# EAGLE design sensors (EAGLE 5.05)
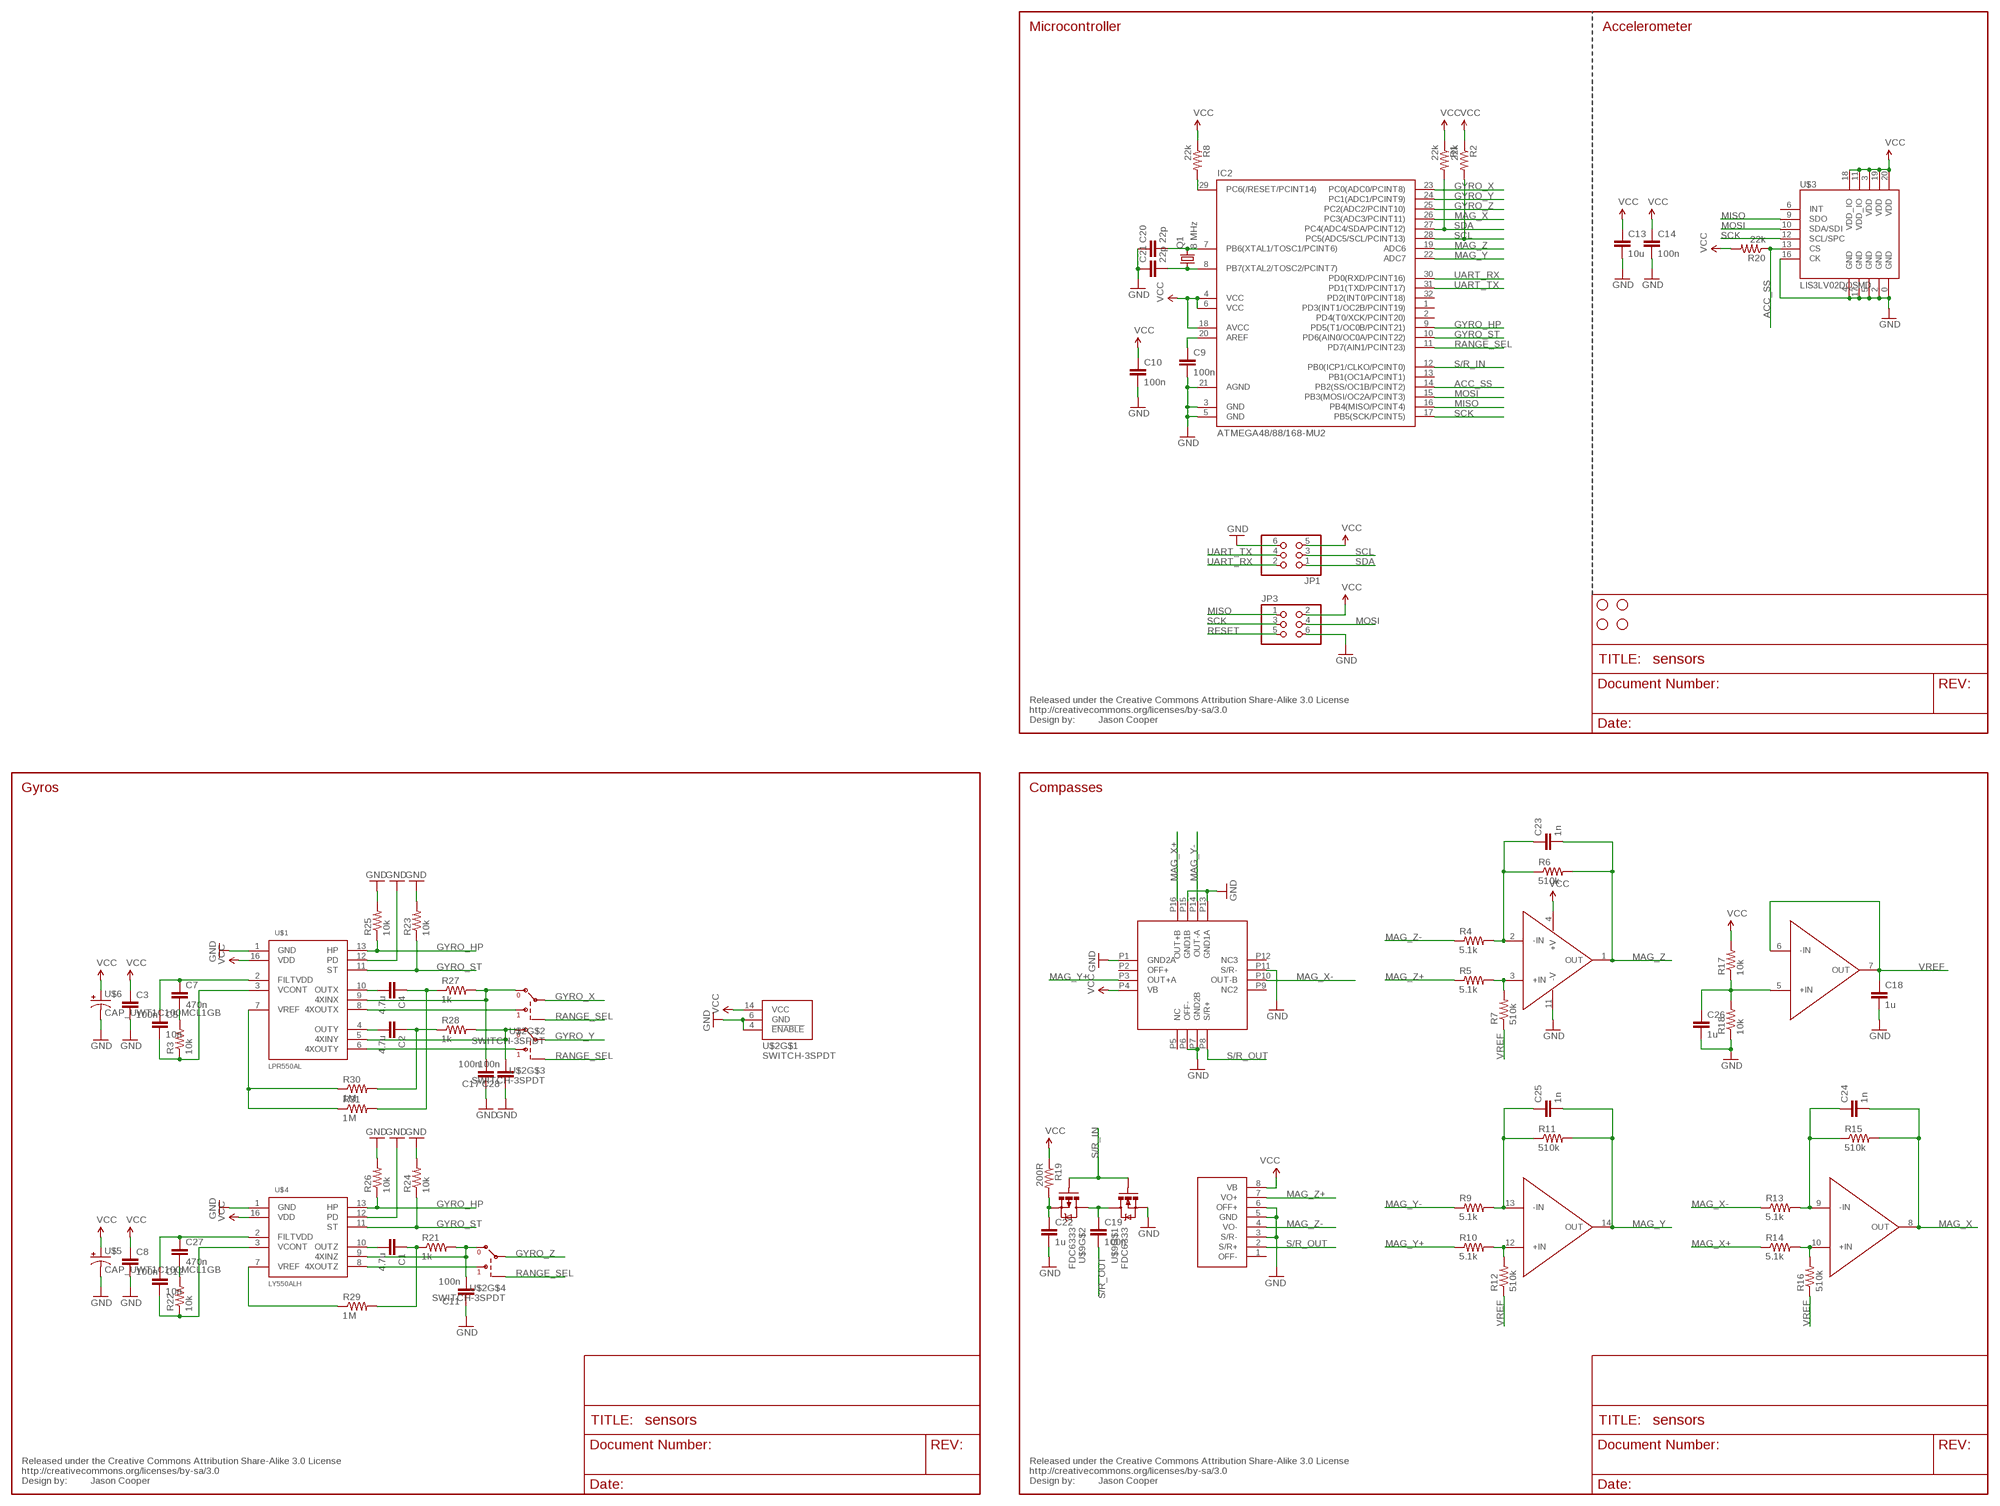
[diagram p0: schematic, sheet 1]

## Parts
C1  4.7u  C-EUC0805  [C0805]
C2  4.7u  C-EUC0805  [C0805]
C3  100n  C-EUC0805  [C0805]
C4  4.7u  C-EUC0805  [C0805]
C5  10n  C-EUC0805  [C0805]
C7  470n  C-EUC0805  [C0805]
C8  100n  C-EUC0805  [C0805]
C9  100n  C-EUC0805  [C0805]
C10  100n  C-EUC0805  [C0805]
C11  100n  C-EUC0805  [C0805]
C12  10n  C-EUC0805  [C0805]
C13  10u  C-EUC0805  [C0805]
C14  100n  C-EUC0805  [C0805]
C17  100n  C-EUC0805  [C0805]
C18  1u  C-EUC0805  [C0805]
C19  100n  C-EUC0805  [C0805]
C20  22p  C-EUC0805  [C0805]
C21  22p  C-EUC0805  [C0805]
C22  1u  C-EUC0805  [C0805]
C23  1n  C-EUC0805  [C0805]
C24  1n  C-EUC0805  [C0805]
C25  1n  C-EUC0805  [C0805]
C26  1u  C-EUC0805  [C0805]
C27  470n  C-EUC0805  [C0805]
C28  100n  C-EUC0805  [C0805]
IC2  ATMEGA48/88/168-MU2  [QFN32]
JP1  PINHD-2X3  [2X03]
JP2  STAND-OFF  [STAND-OFF]
JP3  PINHD-2X3  [2X03]
JP4  STAND-OFF  [STAND-OFF]
JP5  STAND-OFF  [STAND-OFF]
JP6  STAND-OFF  [STAND-OFF]
Q1  8 MHz  CRYSTAL5X3  [CRYSTAL-SMD-5X3]
R1  22k  R-US_R0805  [R0805]
R2  22k  R-US_R0805  [R0805]
R3  10k  R-US_R0805  [R0805]
R4  5.1k  R-US_R0805  [R0805]
R5  5.1k  R-US_R0805  [R0805]
R6  510k  R-US_R0805  [R0805]
R7  510k  R-US_R0805  [R0805]
R8  22k  R-US_R0805  [R0805]
R9  5.1k  R-US_R0805  [R0805]
R10  5.1k  R-US_R0805  [R0805]
R11  510k  R-US_R0805  [R0805]
R12  510k  R-US_R0805  [R0805]
R13  5.1k  R-US_R0805  [R0805]
R14  5.1k  R-US_R0805  [R0805]
R15  510k  R-US_R0805  [R0805]
R16  510k  R-US_R0805  [R0805]
R17  10k  R-US_R0805  [R0805]
R18  10k  R-US_R0805  [R0805]
R19  200R  R-US_R0805  [R0805]
R20  22k  R-US_R0805  [R0805]
R21  1k  R-US_R0805  [R0805]
R22  10k  R-US_R0805  [R0805]
R23  10k  R-US_R0805  [R0805]
R24  10k  R-US_R0805  [R0805]
R25  10k  R-US_R0805  [R0805]
R26  10k  R-US_R0805  [R0805]
R27  1k  R-US_R0805  [R0805]
R28  1k  R-US_R0805  [R0805]
R29  1M  R-US_R0805  [R0805]
R30  1M  R-US_R0805  [R0805]
R31  1M  R-US_R0805  [R0805]
U$1  LPR550AL  [LGA16]
U$2  SWITCH-3SPDT  [QFN16]
U$3  LIS3LV02DQSMD  [QFN-28]
U$4  LY550ALH  [LGA16]
U$5  CAP_UWT1C100MCL1GB  [CAP_UWT1C100MCL1GB]
U$6  CAP_UWT1C100MCL1GB  [CAP_UWT1C100MCL1GB]
U$7  HMC1052L  [16LPCC]
U$8  LMV324  [SO014]
U$9  FDC6333  [SSOT-6]
U$10  HMC1051ZL  [HMC1051ZL]
U$11  CREATIVE_COMMONS  [CREATIVE_COMMONS]
U$13  CREATIVE_COMMONS  [CREATIVE_COMMONS]
U$17  CREATIVE_COMMONS  [CREATIVE_COMMONS]

## Nets
ACC_SS: IC2.14(PB2(SS/OC1B/PCINT2)) R20.1 U$3.13(CS)
GND: C3.2 C8.2 C9.2 C10.2 C11.1 C13.2 C14.2 C17.1 C18.2 C20.1 C21.1 C22.2 C26.2 C28.1 IC2.3(GND) IC2.5(GND) IC2.21(AGND) JP1.6 JP3.6 R18.1 R23.2 R24.2 R25.2 R26.2 U$1.1(GND) U$1.12(PD) U$2.4(!ENABLE) U$2.6(GND) U$3.0(GND) U$3.2(GND) U$3.4(GND) U$3.5(GND) U$3.16(CK) U$3.17(GND) U$4.1(GND) U$4.12(PD) U$5.NEG(-) U$6.NEG(-) U$7.P1(GND2A) U$7.P6(OFF-) U$7.P7(GND2B) U$7.P11(S/R-) U$7.P13(GND1A) U$7.P15(GND1B) U$8.11(-V) U$9.P$5(S) U$10.3(S/R-) U$10.5(GND) U$10.6(OFF+)
GYRO_HP: IC2.9(PD5(T1/OC0B/PCINT21)) R25.1 R26.1 U$1.13(HP) U$4.13(HP)
GYRO_ST: IC2.10(PD6(AIN0/OC0A/PCINT22)) R23.1 R24.1 U$1.11(ST) U$4.11(ST)
GYRO_X: IC2.23(PC0(ADC0/PCINT8)) U$2.12(COM)
GYRO_Y: IC2.24(PC1(ADC1/PCINT9)) U$2.13(COM)
GYRO_Z: IC2.25(PC2(ADC2/PCINT10)) U$2.2(COM)
MAG_X: C24.2 IC2.26(PC3(ADC3/PCINT11)) R15.2 U$8.8(OUT)
MAG_X+: R14.1 U$7.P16(OUT+B)
MAG_X-: R13.1 U$7.P10(OUT-B)
MAG_Y: C25.2 IC2.22(ADC7) R11.2 U$8.14(OUT)
MAG_Y+: R10.1 U$7.P3(OUT+A)
MAG_Y-: R9.1 U$7.P14(OUT-A)
MAG_Z: C23.2 IC2.19(ADC6) R6.2 U$8.1(OUT)
MAG_Z+: R5.1 U$10.7(VO+)
MAG_Z-: R4.1 U$10.4(VO-)
MISO: IC2.16(PB4(MISO/PCINT4)) JP3.1 U$3.9(SDO)
MOSI: IC2.15(PB3(MOSI/OC2A/PCINT3)) JP3.4 U$3.10(SDA/SDI)
N$1: U$1.8(4XOUTX) U$2.11(NO)
N$2: C5.1 C7.1 U$1.2(FILTVDD)
N$3: C1.2 U$4.10(OUTZ)
N$4: C1.1 R21.1 R29.2
N$5: R29.1 U$4.7(VREF)
N$6: C5.2 R3.1 U$1.3(VCONT)
N$7: C9.1 IC2.20(AREF)
N$8: C4.2 U$1.10(OUTX)
N$9: C2.2 U$1.4(OUTY)
N$10: C2.1 R28.1 R30.2
N$11: R30.1 R31.1 U$1.7(VREF)
N$12: C7.2 R3.2
N$13: C4.1 R27.1 R31.2
N$16: C23.1 R4.2 R6.1 U$8.2(-IN)
N$17: R5.2 R7.2 U$8.3(+IN)
N$18: C25.1 R9.2 R11.1 U$8.13(-IN)
N$19: R10.2 R12.2 U$8.12(+IN)
N$21: C24.1 R13.2 R15.1 U$8.9(-IN)
N$22: R14.2 R16.2 U$8.10(+IN)
N$23: C26.1 R17.1 R18.2 U$8.5(+IN)
N$24: C19.1 U$9.P$4(D) U$9.P$6(D)
N$25: C22.1 R19.2 U$9.P$2(S)
N$26: C11.2 R21.2 U$2.3(NC) U$4.9(4XINZ)
N$27: U$2.1(NO) U$4.8(4XOUTZ)
N$28: C12.1 C27.1 U$4.2(FILTVDD)
N$29: C12.2 R22.1 U$4.3(VCONT)
N$30: C27.2 R22.2
N$33: C28.2 R28.2 U$1.5(4XINY) U$2.16(NC)
N$34: C17.2 R27.2 U$1.9(4XINX) U$2.10(NC)
N$36: U$1.6(4XOUTY) U$2.15(NO)
N$37: C20.2 IC2.7(PB6(XTAL1/TOSC1/PCINT6)) Q1.3
N$38: C21.2 IC2.8(PB7(XTAL2/TOSC2/PCINT7)) Q1.1
RANGE_SEL: IC2.11(PD7(AIN1/PCINT23)) U$2.7(IN) U$2.8(IN) U$2.9(IN)
RESET: IC2.29(PC6(/RESET/PCINT14)) JP3.5 R8.2
S/R_IN: IC2.12(PB0(ICP1/CLKO/PCINT0)) U$9.P$1(G) U$9.P$3(G)
S/R_OUT: C19.2 U$7.P8(S/R+) U$10.2(S/R+)
SCK: IC2.17(PB5(SCK/PCINT5)) JP3.3 U$3.12(SCL/SPC)
SCL: IC2.28(PC5(ADC5/SCL/PCINT13)) JP1.3 R2.2
SDA: IC2.27(PC4(ADC4/SDA/PCINT12)) JP1.1 R1.2
UART_RX: IC2.30(PD0(RXD/PCINT16)) JP1.2
UART_TX: IC2.31(PD1(TXD/PCINT17)) JP1.4
VCC: C3.1 C8.1 C10.1 C13.1 C14.1 IC2.4(VCC) IC2.6(VCC) IC2.18(AVCC) JP1.5 JP3.2 R1.1 R2.1 R8.1 R17.2 R19.1 R20.2 U$1.16(VDD) U$2.14(VCC) U$3.3(VDD) U$3.11(VDD_IO) U$3.18(VDD_IO) U$3.19(VDD) U$3.20(VDD) U$4.16(VDD) U$5.POS(+) U$6.POS(+) U$7.P4(VB) U$8.4(+V) U$10.8(VB)
VREF: C18.1 R7.1 R12.1 R16.1 U$8.6(-IN) U$8.7(OUT)
Unconnected: IC2.1(PD3(INT1/OC2B/PCINT19)) IC2.2(PD4(T0/XCK/PCINT20)) IC2.13(PB1(OC1A/PCINT1)) IC2.32(PD2(INT0/PCINT18)) U$3.6(INT) U$7.P2(OFF+) U$7.P5(NC) U$7.P9(NC2) U$7.P12(NC3) U$10.1(OFF-)

## Notes on the sheet
- Microcontroller | Accelerometer
- Jason Cooper
- Gyros | Compasses
- Jason Cooper | Jason Cooper

## Library data of the parts
C1-C5 C7-C14 C17-C28 = rcl:C-EU: CAPACITOR, European symbol
IC2 = jason:ATMEGA48/88/168
JP1 JP3 = jason:PINHD-2X3: PIN HEADER
JP2 JP4-JP6 = jason:STAND-OFF: Stand Off This is the mechanical footprint for a #4 phillips button head screw. Use the keepout ring to avoid running the screw head into surrounding components. SKU : PRT-00447
Q1 = jason:CRYSTAL: Crystals Various standard crystals. Proven footprints. Spark Fun Electronics SKU : COM-00534
R1-R31 = rcl:R-US_: RESISTOR, American symbol
U$1 = jason:LPR550AL: LPR550AL
U$2 = jason:SWITCH-3SPDT
U$3 = jason:LIS3LV02DQ
U$4 = jason:LY550ALH: LY550ALH
U$5 U$6 = jason:CAP_UWT1C100MCL1GB
U$7 = jason:HMC1052L: HMC1052L Dual axis magnetic sensor. Used for compass and magnetometer applications. Schematic and footprint are not tested and probably need fixing. Spark Fun Electronics SKU : COM-00708
U$8 = jason:LMV324
U$9 = jason:FDC6333
U$10 = jason:HMC1051ZL
U$11 U$13 U$17 = SparkFun:CREATIVE_COMMONS

## Board
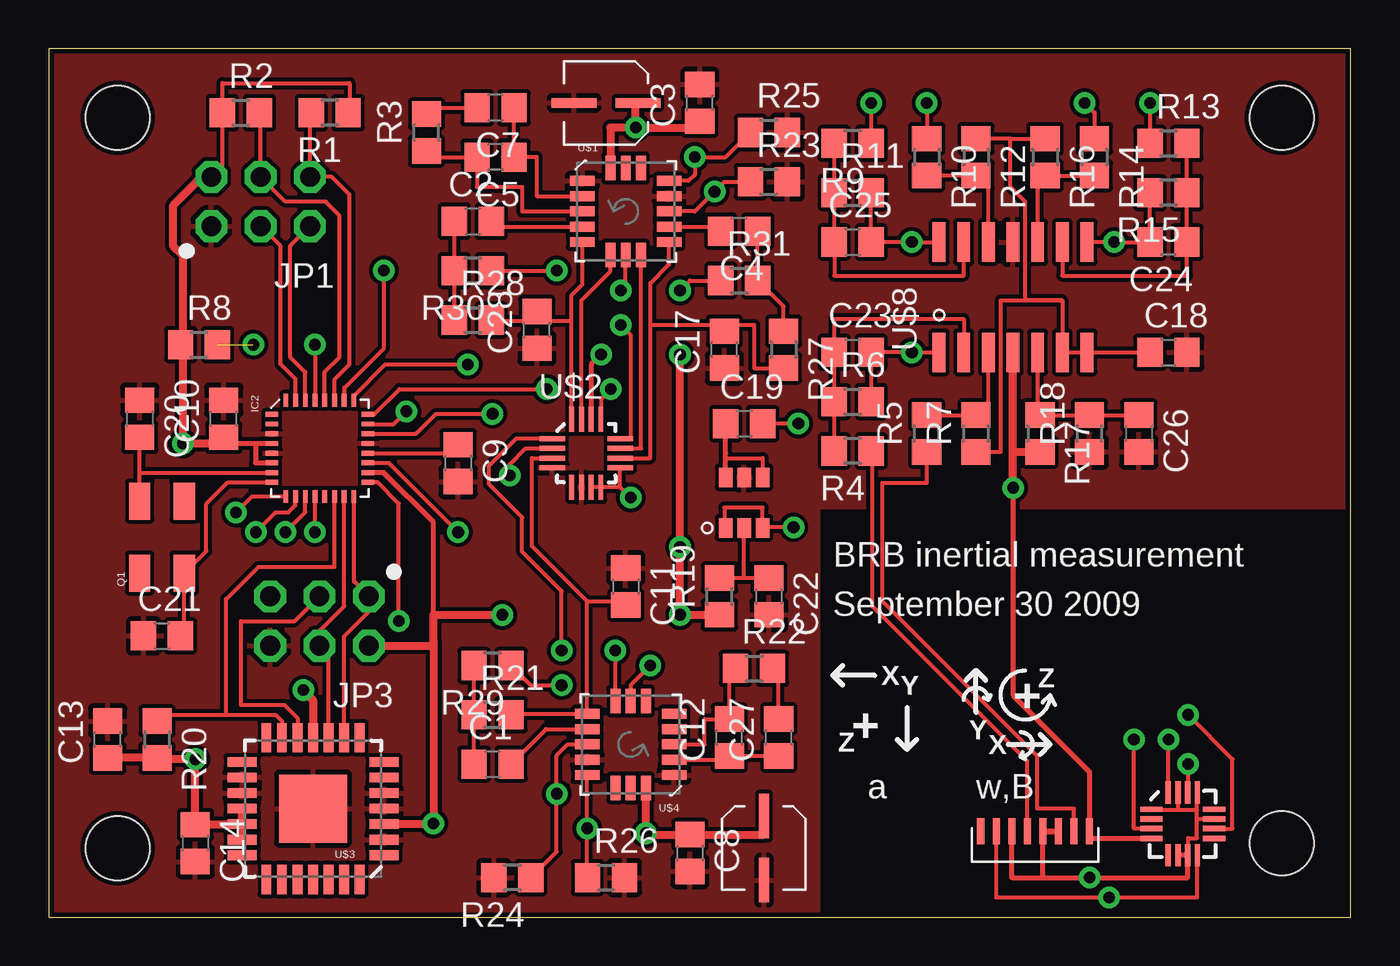
[diagram p1: board, top side]
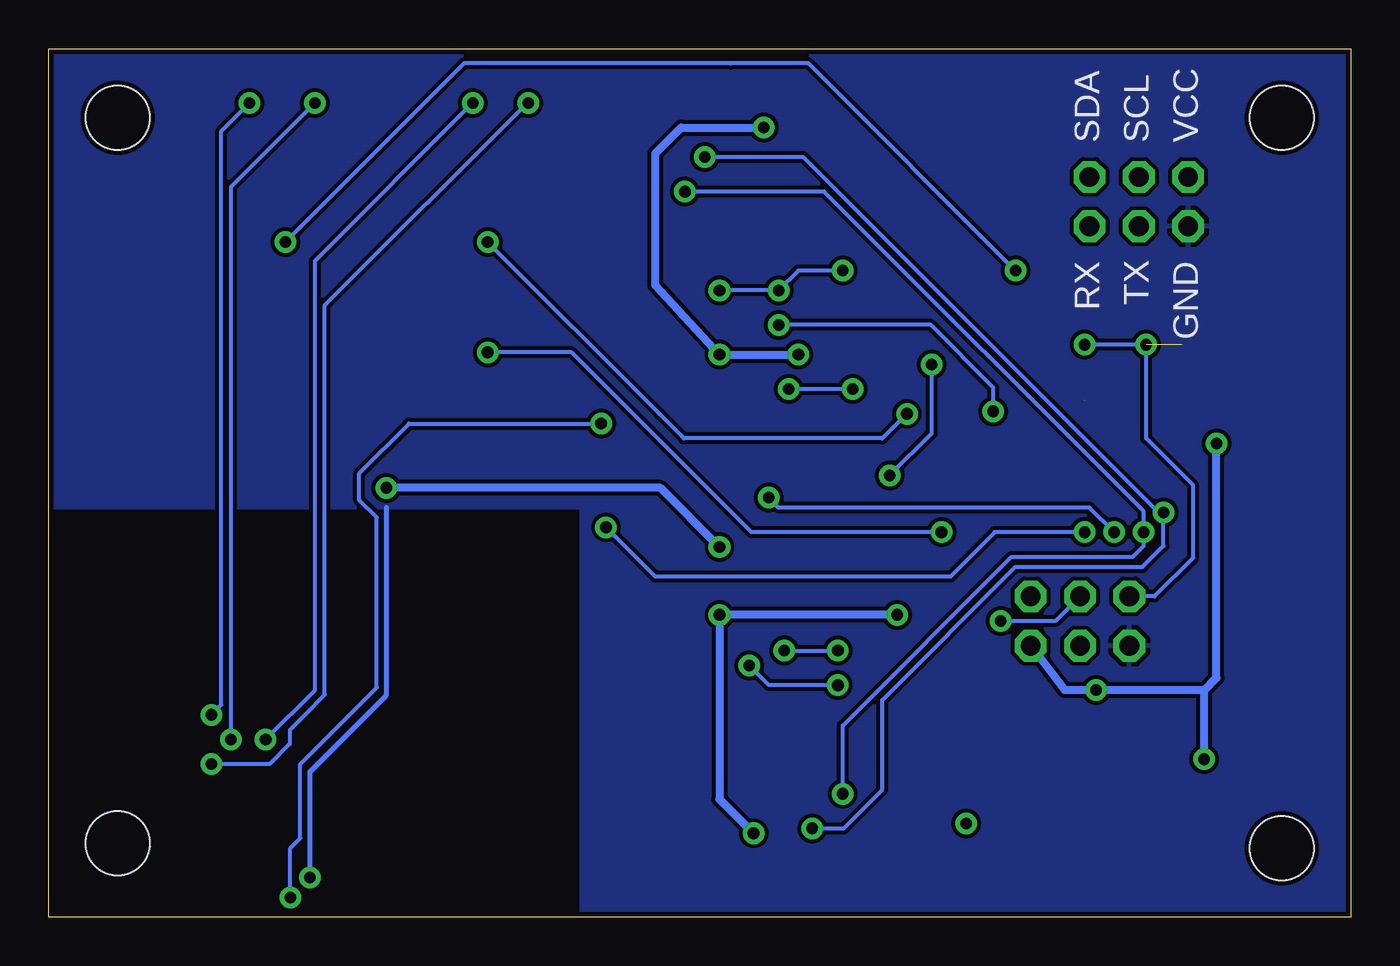
[diagram p2: board, bottom side, seen from below]

Size 67.06 x 44.7 mm. Coordinates in mm from the lower left corner, seen from the top.
Outline: 0,0 67.06,0 67.06,44.7 0,44.7 0,0
Copper layers (1*16): Top 0.035mm / dielectric 1.5mm / Bottom 0.035mm
Design rules "SparkFun": minimum track width 8mil, minimum drill 20mil, track to track 8mil, track to pad 8mil, pad to pad 8mil, via to via 8mil, smd to smd 8mil, copper to edge 10mil, drill to drill 8mil, minimum pad ring 12mil, minimum via ring 10mil, stop-mask expansion 4mil, vias tented up to drill 25mil, thermal gap 10mil

### Footprints (pad centres in the part's own frame; a part is rotated, then mirrored left to right if it is on the bottom)
C0805 = smd 1.3 x 1.5: 1 -0.95,0; 2 0.95,0
QFN32 = smd 0.25 x 0.65: 1 -1.75,-2.475; 2 -1.25,-2.475; 3 -0.75,-2.475; 4 -0.25,-2.475; 5 0.25,-2.475; 6 0.75,-2.475; 7 1.25,-2.475; 8 1.75,-2.475; 17 1.75,2.475; 18 1.25,2.475; 19 0.75,2.475; 20 0.25,2.475; 21 -0.25,2.475; 22 -0.75,2.475; 23 -1.25,2.475; 24 -1.75,2.475 | smd 0.65 x 0.25: 9 2.475,-1.75; 10 2.475,-1.25; 11 2.475,-0.75; 12 2.475,-0.25; 13 2.475,0.25; 14 2.475,0.75; 15 2.475,1.25; 16 2.475,1.75; 25 -2.475,1.75; 26 -2.475,1.25; 27 -2.475,0.75; 28 -2.475,0.25; 29 -2.475,-0.25; 30 -2.475,-0.75; 31 -2.475,-1.25; 32 -2.475,-1.75
2X03 = drill 1.016 octagon: 1 -2.54,-1.27; 2 -2.54,1.27; 3 0,-1.27; 4 0,1.27; 5 2.54,-1.27; 6 2.54,1.27
STAND-OFF = hole 3.302: 0,0
CRYSTAL-SMD-5X3 = smd 1.9 x 1.1: 1 -1.85,-1.15; 2 1.85,-1.15; 3 1.85,1.15; 4 -1.85,1.15
R0805 = smd 1.3 x 1.5: 1 -0.95,0; 2 0.95,0
LGA16 = smd 1.27 x 0.508: 1 -2.235,1.575; 2 -2.235,0.787; 3 -2.235,0; 4 -2.235,-0.787; 5 -2.235,-1.575; 9 2.235,-1.575; 10 2.235,-0.787; 11 2.235,0; 12 2.235,0.787; 13 2.235,1.575 | smd 0.508 x 1.27: 6 -0.787,-2.235; 7 0,-2.235; 8 0.787,-2.235; 14 0.787,2.235; 15 0,2.235; 16 -0.787,2.235
QFN16 = smd 1.3 x 0.25: 1 -1.75,0.75; 2 -1.75,0.25; 3 -1.75,-0.25; 4 -1.75,-0.75; 9 1.75,-0.75; 10 1.75,-0.25; 11 1.75,0.25; 12 1.75,0.75 | smd 0.25 x 1.3: 5 -0.75,-1.75; 6 -0.25,-1.75; 7 0.25,-1.75; 8 0.75,-1.75; 13 0.75,1.75; 14 0.25,1.75; 15 -0.25,1.75; 16 -0.75,1.75
QFN-28 = smd 3.5 x 3.5: 0 0,0 | smd 1.5 x 0.5: 1 -3.65,2.4; 2 -3.65,1.6; 3 -3.65,0.8; 4 -3.65,0; 5 -3.65,-0.8; 6 -3.65,-1.6; 7 -3.65,-2.4; 15 3.65,-2.4; 16 3.65,-1.6; 17 3.65,-0.8; 18 3.65,0; 19 3.65,0.8; 20 3.65,1.6; 21 3.65,2.4 | smd 0.5 x 1.5: 8 -2.4,-3.65; 9 -1.6,-3.65; 10 -0.8,-3.65; 11 0,-3.65; 12 0.8,-3.65; 13 1.6,-3.65; 14 2.4,-3.65; 22 2.4,3.65; 23 1.6,3.65; 24 0.8,3.65; 25 0,3.65; 26 -0.8,3.65; 27 -1.6,3.65; 28 -2.4,3.65
CAP_UWT1C100MCL1GB = smd 0.5 x 2.3: NEG 0,-1.65; POS 0,1.65
16LPCC = smd 1.15 x 0.28: P1 -0.12,2.25; P2 -0.12,1.75; P3 -0.12,1.25; P4 -0.12,0.75; P9 3.12,0.75; P10 3.12,1.25; P11 3.12,1.75; P12 3.12,2.25 | smd 0.28 x 1.15: P5 0.75,-0.12; P6 1.25,-0.12; P7 1.75,-0.12; P8 2.25,-0.12; P13 2.25,3.12; P14 1.75,3.12; P15 1.25,3.12; P16 0.75,3.12
SO014 = smd 0.66 x 2.032: 1 -3.175,-2.68; 2 -1.905,-2.68; 3 -0.635,-2.68; 4 0.635,-2.68; 5 1.905,-2.68; 6 3.175,-2.68; 7 4.445,-2.68; 8 4.445,2.997; 9 3.175,2.997; 10 1.905,2.997; 11 0.635,2.997; 12 -0.635,2.997; 13 -1.905,2.997; 14 -3.175,2.997
SSOT-6 = smd 0.7 x 1: P$1 -0.95,-1.3; P$2 0,-1.3; P$3 0.95,-1.3; P$4 0.95,1.3; P$5 0,1.3; P$6 -0.95,1.3
HMC1051ZL = smd 0.368 x 1.321: 1 5.601,0.152; 2 4.801,0.152; 3 4,0.152; 4 3.2,0.152; 5 2.4,0.152; 6 1.6,0.152; 7 0.8,0.152; 8 0,0.152

### Placement (x,y rotation side)
C1  22.86,7.87 0 top
C2  21.84,35.81 0 top
C3  33.53,41.91 90 top
C4  35.56,35.31 180 top
C5  23.01,39.12 180 top
C7  23.01,41.66 180 top
C8  33.02,3.3 270 top
C9  21.08,23.37 270 top
C10  9.02,25.65 90 top
C11  29.72,17.02 270 top
C12  35.05,9.25 90 top
C13  3.05,9.14 90 top
C14  7.55,3.81 270 top
C17  34.8,29.21 90 top
C18  57.66,29.07 0 top
C19  35.81,25.4 0 top
C20  4.69,25.65 270 top
C21  5.84,14.48 0 top
C22  37.08,16.51 270 top
C23  41.4,29.07 0 top
C24  57.66,34.75 180 top
C25  41.4,34.75 0 top
C26  56.13,24.89 270 top
C27  37.59,9.25 90 top
C28  25.15,30.23 90 top
IC2  13.97,24.13 270 top
JP1  10.92,36.83 180 top
JP2  3.56,41.15 0 top
JP3  13.95,15.24 180 top
JP4  3.56,3.56 0 top
JP5  63.5,41.15 0 top
JP6  63.5,3.81 0 top
Q1  5.84,19.56 90 top
R1  14.48,41.4 180 top
R2  9.91,41.4 0 top
R3  19.46,40.39 90 top
R4  41.4,23.99 180 top
R5  45.21,24.89 90 top
R6  41.4,26.53 0 top
R7  47.75,24.89 90 top
R8  7.75,29.46 0 top
R9  41.4,39.83 180 top
R10  45.21,39.12 270 top
R11  41.4,37.29 0 top
R12  47.75,39.12 270 top
R13  57.66,39.83 0 top
R14  53.85,39.12 270 top
R15  57.66,37.29 180 top
R16  51.31,39.12 270 top
R17  51.05,24.89 270 top
R18  53.59,24.89 90 top
R19  34.54,16.51 90 top
R20  5.59,9.14 270 top
R21  22.86,10.41 0 top
R22  36.32,12.8 0 top
R23  37.08,37.85 0 top
R24  23.88,2.03 180 top
R25  37.08,40.39 0 top
R26  28.7,2.03 0 top
R27  37.85,29.21 270 top
R28  21.84,30.73 0 top
R29  22.86,12.95 180 top
R30  21.84,33.27 180 top
R31  35.56,32.77 0 top
U$1  29.72,36.32 0 top
U$2  27.69,23.88 0 top
U$3  13.62,5.59 180 top
U$4  29.97,8.89 180 top
U$5  36.83,3.56 0 top
U$6  28.7,41.91 270 top
U$7  56.9,3.3 0 top
U$8  49.02,31.75 0 top
U$9  35.81,21.34 0 top
U$10  53.59,4.57 180 top
U$11  15.75,-9.4 0 top  (outside the outline)
U$13  15.75,-9.4 0 top  (outside the outline)
U$17  15.75,-9.4 0 top  (outside the outline)

### Tracks (layer width: path | path; a pad name or v marks a point on that pad's centre or on a via)
ACC_SS
  Top 0.203: IC2.14 14.72,18.03 10.81,18.03 9.14,16.37 9.14,10.41 | 9.14,10.41 5.75,10.41 R20.1 | 9.14,10.41 11.68,10.41 12.02,10.08 U$3.13
GND  (via drill 0.6)
  Top 0.203: 59.13,5.05 59.15,5.05 | 59.13,5.05 U$7.P11 | U$10.3 49.53,4.42 | U$7.P1 57.15,5.55 57.15,5.51 58.15,5.51 U$7.P15 58.17,6.17 58.17,5.51 59.13,5.51 | U$7.P13 59.13,6.17 59.13,5.51 | 59.13,5.05 59.13,5.51 | U$7.P7 58.67,3.43 58.67,4.06 59.13,4.06 59.13,5.05
  Top 0.254: 51.19,2.03 49.59,2.03 U$10.3 | 51.19,2.03 U$10.5 | U$7.P6 U$7.P7 58.65,2.03 v53.59,2.03 51.19,2.03
  Top 0.305: U$10.5 U$10.6
  Bottom 0.254: v53.59,2.03 53.59,7.49 49.66,11.43 49.66,21.08
  pour Bottom: 0,44.7 0,0 39.62,0 39.62,21.08 67.06,21.08 67.06,44.7
  pour Top: 67.06,44.7 67.06,21.08 39.62,21.08 39.62,0 0,0 0,44.7
GYRO_HP  (via drill 0.6)
  Top 0.203: U$4.13 v27.74,4.57 27.74,2.03 R26.1 | IC2.9 10.48,21.66 v9.65,20.83 | U$1.13 32.95,37.9 33.27,38.22 v33.27,39.12 34.86,39.12 R25.1
  Bottom 0.203: v27.74,4.57 26.11,4.57 24.13,6.56 24.13,11.18 17.27,18.03 10.73,18.03 9.65,19.11 v9.65,20.83 9.91,20.83 28.19,39.12 v33.27,39.12
GYRO_ST  (via drill 0.6)
  Top 0.203: IC2.10 12.7,21.66 12.7,21.19 12.34,20.83 11.68,20.83 v10.67,19.81 | U$4.11 26.73,8.89 26.16,8.32 v26.16,6.35 26.16,3.37 R24.1 | U$1.11 33.27,36.32 v34.29,37.34 34.8,37.85 R23.1
  Bottom 0.203: v34.29,37.34 27.12,37.34 10.67,20.88 v10.67,19.81 10.67,19.11 11.24,18.54 17.48,18.54 26.16,9.86 v26.16,6.35
GYRO_X  (via drill 0.6)
  Top 0.203: 16.45,25.4 IC2.23 17.76,25.38 v18.41,26.04 | U$2.12 29.97,24.63 29.97,29.97 v29.46,30.48
  Bottom 0.203: v29.46,30.48 21.64,30.48 18.41,27.26 v18.41,26.04
GYRO_Y  (via drill 0.6)
  Top 0.203: IC2.24 16.76,25.88 18.06,27.18 v25.65,27.18 | v28.96,27.18 28.44,26.66 U$2.13
  Bottom 0.203: v25.65,27.18 v28.96,27.18
GYRO_Z  (via drill 0.6)
  Top 0.203: IC2.25 15.72,26.84 17.33,28.45 v21.59,28.45 | 26.19,24.13 U$2.2 24.56,24.13 23.75,23.32 v23.75,22.73
  Bottom 0.203: v21.59,28.45 21.59,24.89 v23.75,22.73
MAG_X  (via drill 0.6)
  Top 0.203: R15.2 C24.2 v54.86,34.75 U$8.8 | IC2.26 15.24,26.61 15.24,27.25 17.27,29.29 v17.27,33.27
  Bottom 0.203: v54.86,34.75 45.67,43.94 31.93,43.94 27.94,43.94 v17.27,33.27
MAG_X+  (via drill 0.6)
  Top 0.203: v53.34,41.91 53.85,41.4 R14.1 | U$7.P16 57.66,6.17 v57.66,9.14
  Bottom 0.203: v57.66,9.14 57.66,37.59 v53.34,41.91
MAG_X-  (via drill 0.6)
  Top 0.203: v56.71,41.91 R13.1 | U$7.P10 60.96,4.55 60.96,8.13 v58.67,10.41
  Bottom 0.203: v58.67,10.41 58.17,10.92 58.17,40.45 v56.71,41.91
MAG_Y  (via drill 0.6)
  Top 0.203: R11.2 C25.2 v44.45,34.75 U$8.14 | IC2.22 18.92,24.88 19.95,25.91 v22.86,25.91
  Bottom 0.203: 44.45,34.8 v44.45,34.75 35.61,25.91 34.34,24.64 24.13,24.64 v22.86,25.91
MAG_Y+  (via drill 0.6)
  Top 0.203: v45.21,41.91 R10.1 | U$7.P3 55.88,4.55 v55.88,9.14
  Bottom 0.203: v55.88,9.14 53.34,11.68 53.34,33.78 v45.21,41.91
MAG_Y-  (via drill 0.6)
  Top 0.203: v42.35,41.91 R9.1 | v58.67,7.87 58.65,7.37 U$7.P14
  Bottom 0.203: v58.67,7.87 55.68,7.87 54.63,8.92 54.63,9.63 53.85,10.41 52.83,11.45 52.83,31.5 42.35,41.98 v42.35,41.91
MAG_Z  (via drill 0.6)
  Top 0.203: R6.2 C23.2 v44.45,29.07 U$8.1 | v21.08,19.81 17.53,23.37 17.53,23.38 IC2.19
  Bottom 0.203: v21.08,19.81 30.87,19.81 40.13,29.07 v44.45,29.07
MAG_Z+
  Top 0.203: U$10.7 52.79,5.59 50.9,5.59 50.9,8.28 42.93,16.26 42.93,22.35 45.21,22.35 R5.1
MAG_Z-
  Top 0.203: R4.1 42.42,23.99 42.42,16 50.39,8.03 U$10.4
MISO
  Top 0.203: IC2.16 15.72,17.28 JP3.1 16.49,15.73 15.22,14.46 U$3.9
MOSI
  Top 0.203: IC2.15 15.22,16 13.95,14.73 JP3.4 14.42,13.5 U$3.10
N$1
  Top 0.203: U$2.11 30.5,24.13 U$1.8
N$2
  Top 0.203: C5.1 C7.1 | C5.1 23.39,39.12 | C5.1 25.15,39.12 25.15,37.11 U$1.2
N$3
  Top 0.203: U$4.10 25.61,9.68 25.4,9.46 C1.2
N$4
  Top 0.203: C1.1 R21.1 R29.2
N$5  (via drill 0.6)
  Top 0.203: v26.42,11.94 24.83,11.94 R29.1 | v30.99,12.95 29.97,11.94 U$4.7
  Bottom 0.203: v26.42,11.94 29.97,11.94 v30.99,12.95
N$6
  Top 0.203: R3.1 19.56,39.12 C5.2 | C5.2 22.61,39.12 | U$1.3 24.38,36.32 24.38,37.59 22.06,37.59 C5.2
N$7
  Top 0.203: IC2.20 21.08,23.88 C9.1
N$8
  Top 0.203: U$1.10 34.61,35.53 C4.2
N$9
  Top 0.203: U$1.4 22.79,35.53 C2.2
N$10
  Top 0.203: C2.1 R30.2 R28.1
N$11  (via drill 0.6)
  Top 0.203: R30.1 v26.16,33.27 | v29.46,32.26 29.72,32.51 U$1.7 | R31.1 33.02,32.77 v32.51,32.26
  Bottom 0.203: v26.16,33.27 28.45,33.27 v29.46,32.26 v32.51,32.26
N$12
  Top 0.203: R3.2 19.56,41.66 C7.2
N$13
  Top 0.203: C4.1 R31.2 37.85,31.43 R27.1
N$16
  Top 0.203: U$8.2 47.12,30.8 40.45,30.8 C23.1 R6.1 R4.2
N$17
  Top 0.203: R5.2 R7.2 48.39,25.84 U$8.3
N$18
  Top 0.203: U$8.13 47.12,33.02 40.45,33.02 C25.1 R11.1 R9.2
N$19
  Top 0.203: R10.2 R12.2 48.39,38.17 U$8.12
N$21
  Top 0.203: U$8.9 52.2,33.02 58.61,33.02 C24.1 R15.1 R13.2
N$22
  Top 0.203: R14.2 R16.2 50.93,38.17 U$8.10
N$23
  Top 0.203: C26.1 R18.2 R17.1 50.93,25.84 U$8.5
N$24
  Top 0.203: U$9.P$4 36.76,23.62 34.86,23.62 34.86,23.88
  Top 0.254: U$9.P$6 34.86,23.88 C19.1
N$25
  Top 0.203: R19.2 35.81,17.46 | 35.81,17.46 C22.1 | 35.81,17.46 U$9.P$2
N$26
  Top 0.203: 27.74,16.26 U$4.9 23.81,10.46 R21.2 | U$2.3 26.19,23.62 24.89,23.62 24.89,19.1 27.74,16.26 | 27.74,16.26 29.72,16.26 C11.2
N$27  (via drill 0.6)
  Top 0.203: U$4.8 v29.18,13.72 | U$2.1 26.19,24.64 24.09,24.64 22.67,23.23 22.67,22.28 24.38,20.57 24.38,18.81 26.42,16.77 v26.42,13.72
  Bottom 0.203: v29.18,13.72 v26.42,13.72
N$28
  Top 0.203: C27.1 C12.1 35.05,8.1 U$4.2
N$29
  Top 0.203: R22.1 35.05,12.45 C12.2 33.78,10.2 33.78,8.89 U$4.3
N$30
  Top 0.203: R22.2 37.59,12.45 C27.2
N$33
  Top 0.203: U$2.16 26.92,25.38 26.92,30.67 | U$1.5 27.48,32.56 26.92,32 26.92,30.73 26.92,30.67 | R28.2 22.79,30.67 25.15,30.67 | 26.92,30.67 25.15,30.67 | 25.15,30.67 C28.2
N$34
  Top 0.203: U$1.9 31.95,33.59 30.99,32.63 30.99,30.48 | U$2.10 30.99,23.63 30.99,30.48 | R27.2 36.32,28.26 36.32,30.48 34.8,30.48 | 30.99,30.48 34.8,30.48 | 34.8,30.48 C17.2
N$36
  Top 0.203: U$2.15 27.43,25.38 27.43,31.75 28.93,33.25 U$1.6
N$37
  Top 0.203: Q1.3 4.69,22.86 | 4.69,22.86 C20.2 | IC2.7 4.69,22.88 4.69,22.86
N$38
  Top 0.203: C21.2 6.99,14.22 Q1.1 8.13,18.84 8.13,21.28 9.23,22.38 IC2.8
RANGE_SEL  (via drill 0.6)
  Top 0.203: U$2.7 U$2.8 29.44,22.13 | v12.19,19.81 13.22,20.84 IC2.11 | 29.44,22.13 U$2.9 | v29.97,21.59 29.44,22.13
  Bottom 0.203: v29.97,21.59 29.46,21.08 13.46,21.08 v12.19,19.81
RESET  (via drill 0.6)  (2 unrouted)
  Top 0.203: v13.72,29.46 IC2.29 | R8.2 8.32,28.96
  Bottom 0.203: v13.72,29.46 v10.54,29.46 10.54,24.64 8.13,22.23 8.13,18.49 10.11,16.51 JP3.5
S/R_IN  (via drill 0.6)
  Top 0.203: U$9.P$1 34.8,20.04 34.8,21.08 36.76,21.08 36.76,20.07 | v38.35,20.07 36.76,20.07 | 36.76,20.07 U$9.P$3 | v13.72,19.81 IC2.12
  Bottom 0.203: v13.72,19.81 18.34,19.81 20.62,17.53 35.81,17.53 v38.35,20.07
S/R_OUT  (via drill 0.6)
  Top 0.203: U$7.P8 59.15,1.02 v54.61,1.02 48.79,1.02 U$10.2 | v38.61,25.4 C19.2
  Bottom 0.203: v38.61,25.4 48.5,25.4 51.05,22.84 51.05,21.46 50.16,20.57 50.16,11.81 54.1,7.87 54.1,4.06 54.61,3.56 v54.61,1.02
SCK  (via drill 0.6)
  Top 0.203: v18.03,15.24 18.03,21.29 16.94,22.38 IC2.17 | U$3.12 12.82,10.24 12.14,10.92 9.91,10.92 9.91,15.24 12.68,15.24 JP3.3
  Bottom 0.203: v18.03,15.24 15.22,15.24 JP3.3
SCL
  Top 0.203: IC2.28 14.22,28.06 14.99,28.83 14.99,36.11 14.27,36.83 12.19,36.83 JP1.3 10.92,41.4 R2.2
SDA
  Top 0.203: IC2.27 14.72,27.67 15.49,28.45 15.49,37.18 14.58,38.1 JP1.1 13.46,41.4 R1.2
UART_RX
  Top 0.203: IC2.30 13.22,28.05 12.45,28.83 12.45,34.54 JP1.2
UART_TX
  Top 0.203: IC2.31 12.72,27.69 11.94,28.47 11.94,34.54 JP1.4
VCC  (via drill 0.6)
  Top 0.203: IC2.18 16.45,22.86 | U$10.8 53.59,4.05 | JP1.5 8.96,38.67 R2.1 8.96,42.93 15.49,42.93 15.49,41.4 R1.1 | 27.94,25.38 U$2.14
  Top 0.254: 10.67,24.38 IC2.4 | 10.67,23.38 IC2.6 | IC2.18 17.25,22.88 19.81,20.32 19.81,15.56 | 10.67,24.38 10.66,24.38 | 53.59,4.05 U$7.P4 | v49.66,22.1 49.66,11.43 53.59,7.49 U$10.8 | v28.45,28.96 27.94,28.45 27.94,25.38 | 10.67,23.38 10.66,23.38 | 10.67,24.38 10.67,23.38 | 10.67,24.38 8.76,24.38 C10.1
  Top 0.406: 49.66,23.94 U$8.4 | 49.66,23.94 R17.2 | v13.11,11.68 13.62,11.18 U$3.11 | JP1.5 7.89,38.1 6.42,36.63 6.42,34.54 6.92,34.04 6.92,29.46 R8.1 6.92,28.96 v6.92,24.38 8.76,24.38 C10.1 | v49.66,22.1 49.66,23.94 | v32.51,28.96 v32.51,19.05 v32.51,15.56 R19.1 | 19.81,14.22 v19.81,4.83 19.3,4.79 U$3.3 | 19.81,14.22 19.81,15.56 v23.37,15.56 | JP3.2 19.81,13.97 19.81,14.22 | C14.1 v7.55,8.13 6.25,8.13 R20.2 C13.1 | C14.1 7.62,4.79 | U$4.16 v30.76,4.32 30.76,4.25 C8.1 36.83,4.25 U$5.POS | v30.23,40.64 28.93,40.64 U$1.16 | U$3.19 7.55,4.79 C14.1 | U$3.19 U$3.20 | U$3.19 U$3.18 | U$6.POS 30.23,41.91 v30.23,40.64 | v30.23,40.64 33.53,40.64 C3.1
  Bottom 0.406: JP3.2 14.73,11.68 v13.11,11.68 7.55,11.68 | v32.51,19.05 35.56,22.1 v49.66,22.1 | v7.55,8.13 7.55,11.68 | v28.45,28.96 v32.51,28.96 35.81,32.51 35.81,39.31 34.48,40.64 v30.23,40.64 | 7.55,11.68 6.92,12.31 v6.92,24.38 | v23.37,15.56 v32.51,15.56 32.51,6.07 v30.76,4.32
VREF
  Top 0.203: C18.1 U$8.7 U$8.6 52.2,31.75 | 49.53,40.07 R12.1 | 49.53,40.07 R16.1 | 52.2,31.75 49.02,31.75 49.02,23.94 R7.1 | 52.2,31.75 50.29,31.75 50.29,36.83 49.53,37.59 49.53,40.07

### Text on the board
tPlace: BRB inertial measurement | September 30 2009 | X | Y | Z | + | + | Z | Y | X | a | w,B
bPlace: VCC | SCL | SDA | TX | RX | GND